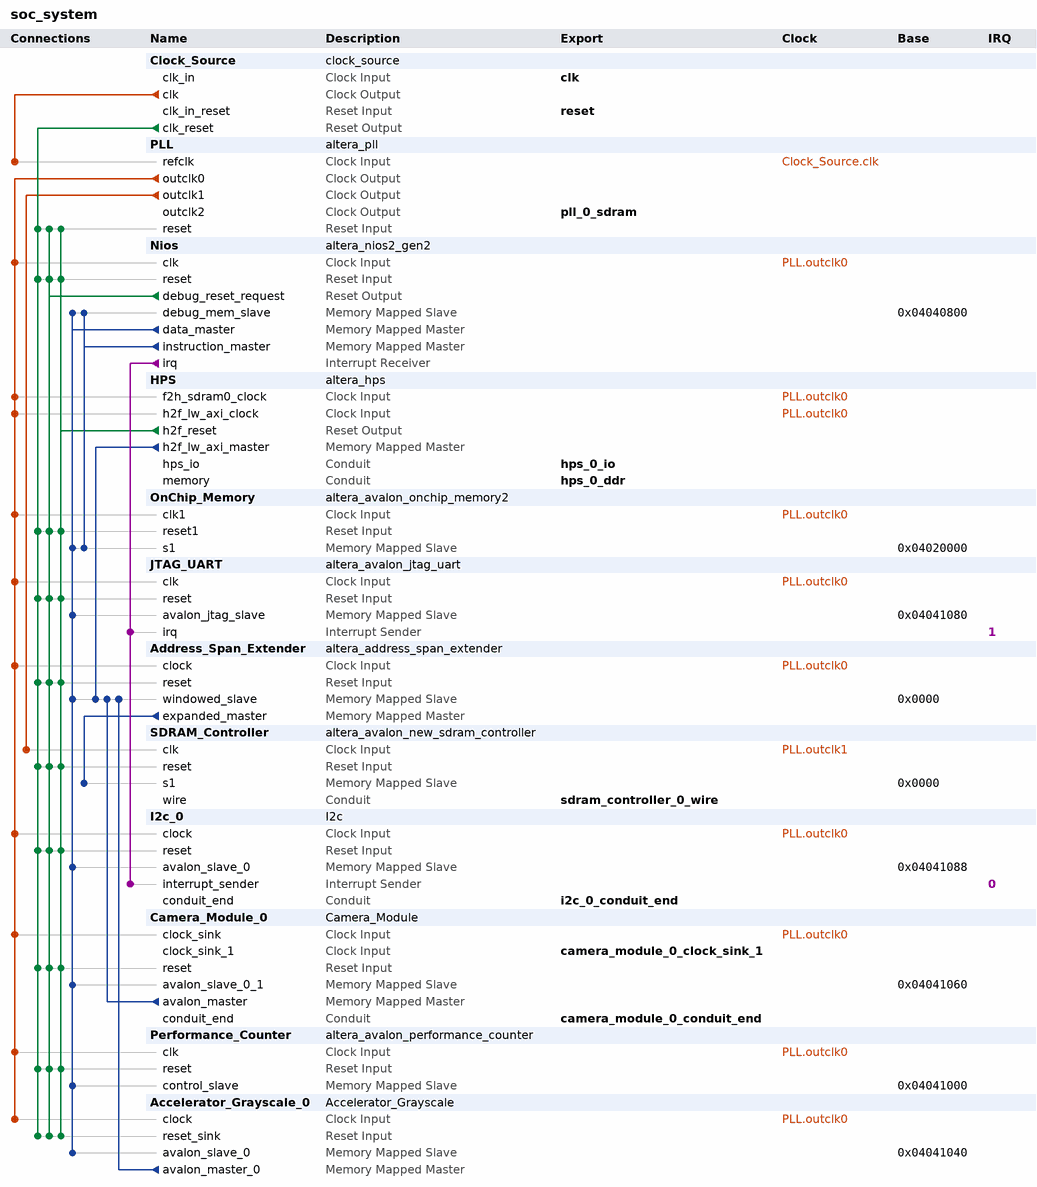
[diagram p0: system contents]
# Platform Designer (Qsys) system soc_system, Cyclone V 5CSEMA5F31C6
# Parameters at their usual value, and those the tool derives, are not listed.
package require -exact qsys 18.1
create_system soc_system
set_project_property DEVICE_FAMILY {Cyclone V}
set_project_property DEVICE 5CSEMA5F31C6

add_instance Clock_Source clock_source 18.1
set_instance_parameter_value Clock_Source clockFrequency 50000000

add_instance PLL altera_pll 18.1
set_instance_parameter_value PLL gui_device_speed_grade 2
set_instance_parameter_value PLL gui_number_of_clocks 3
set_instance_parameter_value PLL gui_operation_mode normal
set_instance_parameter_value PLL gui_output_clock_frequency0 50.0
set_instance_parameter_value PLL gui_output_clock_frequency1 100.0
set_instance_parameter_value PLL gui_output_clock_frequency2 100.0
set_instance_parameter_value PLL gui_phase_shift2 -3758
set_instance_parameter_value PLL gui_pll_mode {Integer-N PLL}
set_instance_parameter_value PLL gui_reference_clock_frequency 50.0
set_instance_parameter_value PLL gui_use_locked false

add_instance Nios altera_nios2_gen2 18.1
set_instance_parameter_value Nios dcache_size 2048
set_instance_parameter_value Nios exceptionSlave OnChip_Memory.s1
set_instance_parameter_value Nios icache_size 4096
set_instance_parameter_value Nios impl Fast
set_instance_parameter_value Nios resetSlave OnChip_Memory.s1

add_instance HPS altera_hps 18.1
set_instance_parameter_value HPS EMAC1_Mode RGMII
set_instance_parameter_value HPS EMAC1_PinMuxing {HPS I/O Set 0}
set_instance_parameter_value HPS F2SCLK_COLDRST_Enable false
set_instance_parameter_value HPS F2SCLK_DBGRST_Enable false
set_instance_parameter_value HPS F2SCLK_WARMRST_Enable false
set_instance_parameter_value HPS F2SDRAM_Type {Avalon-MM Bidirectional}
set_instance_parameter_value HPS F2SDRAM_Width 32
set_instance_parameter_value HPS F2SINTERRUPT_Enable false
set_instance_parameter_value HPS F2S_Width 0
set_instance_parameter_value HPS FPGA_PERIPHERAL_OUTPUT_CLOCK_FREQ_EMAC0_GTX_CLK 100
set_instance_parameter_value HPS FPGA_PERIPHERAL_OUTPUT_CLOCK_FREQ_EMAC0_MD_CLK 100.0
set_instance_parameter_value HPS FPGA_PERIPHERAL_OUTPUT_CLOCK_FREQ_EMAC1_GTX_CLK 100
set_instance_parameter_value HPS FPGA_PERIPHERAL_OUTPUT_CLOCK_FREQ_EMAC1_MD_CLK 100.0
set_instance_parameter_value HPS HPS_PROTOCOL DDR3
set_instance_parameter_value HPS I2C0_Mode I2C
set_instance_parameter_value HPS I2C0_PinMuxing {HPS I/O Set 0}
set_instance_parameter_value HPS I2C1_Mode I2C
set_instance_parameter_value HPS I2C1_PinMuxing {HPS I/O Set 0}
set_instance_parameter_value HPS LWH2F_Enable true
set_instance_parameter_value HPS MEM_BANKADDR_WIDTH 3
set_instance_parameter_value HPS MEM_CLK_FREQ 400.0
set_instance_parameter_value HPS MEM_COL_ADDR_WIDTH 10
set_instance_parameter_value HPS MEM_DQ_WIDTH 32
set_instance_parameter_value HPS MEM_DRV_STR RZQ/7
set_instance_parameter_value HPS MEM_ROW_ADDR_WIDTH 15
set_instance_parameter_value HPS MEM_RTT_NOM RZQ/4
set_instance_parameter_value HPS MEM_RTT_WR RZQ/4
set_instance_parameter_value HPS MEM_TCL 11
set_instance_parameter_value HPS MEM_TFAW_NS 30.0
set_instance_parameter_value HPS MEM_TRAS_NS 35.0
set_instance_parameter_value HPS MEM_TRCD_NS 13.75
set_instance_parameter_value HPS MEM_TRFC_NS 260.0
set_instance_parameter_value HPS MEM_TRP_NS 13.75
set_instance_parameter_value HPS MEM_VENDOR Other
set_instance_parameter_value HPS MEM_WTCL 8
set_instance_parameter_value HPS QSPI_Mode {1 SS}
set_instance_parameter_value HPS QSPI_PinMuxing {HPS I/O Set 0}
set_instance_parameter_value HPS REF_CLK_FREQ 25.0
set_instance_parameter_value HPS S2FCLK_USER2CLK 1
set_instance_parameter_value HPS S2F_Width 0
set_instance_parameter_value HPS SDIO_Mode {4-bit Data}
set_instance_parameter_value HPS SDIO_PinMuxing {HPS I/O Set 0}
set_instance_parameter_value HPS SPIM1_Mode {Single Slave Select}
set_instance_parameter_value HPS SPIM1_PinMuxing {HPS I/O Set 0}
set_instance_parameter_value HPS STM_Enable false
set_instance_parameter_value HPS TIMING_BOARD_AC_SKEW 0.02
set_instance_parameter_value HPS TIMING_BOARD_AC_TO_CK_SKEW 0.01
set_instance_parameter_value HPS TIMING_BOARD_DQ_TO_DQS_SKEW 0.05
set_instance_parameter_value HPS TIMING_BOARD_MAX_CK_DELAY 0.03
set_instance_parameter_value HPS TIMING_BOARD_MAX_DQS_DELAY 0.02
set_instance_parameter_value HPS TIMING_BOARD_SKEW_BETWEEN_DQS 0.06
set_instance_parameter_value HPS TIMING_BOARD_SKEW_CKDQS_DIMM_MAX 0.12
set_instance_parameter_value HPS TIMING_BOARD_SKEW_CKDQS_DIMM_MIN 0.06
set_instance_parameter_value HPS TIMING_BOARD_SKEW_WITHIN_DQS 0.01
set_instance_parameter_value HPS TIMING_TDH 65
set_instance_parameter_value HPS TIMING_TDQSCK 255
set_instance_parameter_value HPS TIMING_TDQSQ 125
set_instance_parameter_value HPS TIMING_TDS 30
set_instance_parameter_value HPS TIMING_TIH 140
set_instance_parameter_value HPS TIMING_TIS 180
set_instance_parameter_value HPS TIMING_TQSH 0.4
set_instance_parameter_value HPS UART0_Mode {No Flow Control}
set_instance_parameter_value HPS UART0_PinMuxing {HPS I/O Set 0}
set_instance_parameter_value HPS USB1_Mode SDR
set_instance_parameter_value HPS USB1_PinMuxing {HPS I/O Set 0}
set_instance_parameter_value HPS desired_cfg_clk_mhz 100.0
set_instance_parameter_value HPS desired_qspi_clk_mhz 400.0

add_instance OnChip_Memory altera_avalon_onchip_memory2 18.1
set_instance_parameter_value OnChip_Memory dataWidth 32
set_instance_parameter_value OnChip_Memory dualPort false
set_instance_parameter_value OnChip_Memory initMemContent true
set_instance_parameter_value OnChip_Memory initializationFileName onchip_mem.hex
set_instance_parameter_value OnChip_Memory memorySize 131072

add_instance JTAG_UART altera_avalon_jtag_uart 18.1
set_instance_parameter_value JTAG_UART simInteractiveOptions NO_INTERACTIVE_WINDOWS

add_instance Address_Span_Extender altera_address_span_extender 18.1
set_instance_parameter_value Address_Span_Extender BURSTCOUNT_WIDTH 1
set_instance_parameter_value Address_Span_Extender DATA_WIDTH 16
set_instance_parameter_value Address_Span_Extender ENABLE_SLAVE_PORT false
set_instance_parameter_value Address_Span_Extender MASTER_ADDRESS_DEF 0
set_instance_parameter_value Address_Span_Extender MASTER_ADDRESS_WIDTH 27
set_instance_parameter_value Address_Span_Extender MAX_PENDING_READS 1
set_instance_parameter_value Address_Span_Extender SLAVE_ADDRESS_WIDTH 19

add_instance SDRAM_Controller altera_avalon_new_sdram_controller 18.1
set_instance_parameter_value SDRAM_Controller TAC 5.4
set_instance_parameter_value SDRAM_Controller TRCD 15.0
set_instance_parameter_value SDRAM_Controller TRP 15.0
set_instance_parameter_value SDRAM_Controller casLatency 3
set_instance_parameter_value SDRAM_Controller columnWidth 10
set_instance_parameter_value SDRAM_Controller dataWidth 16
set_instance_parameter_value SDRAM_Controller generateSimulationModel false
set_instance_parameter_value SDRAM_Controller model single_Micron_MT48LC4M32B2_7_chip
set_instance_parameter_value SDRAM_Controller numberOfBanks 4
set_instance_parameter_value SDRAM_Controller numberOfChipSelects 1
set_instance_parameter_value SDRAM_Controller powerUpDelay 100.0
set_instance_parameter_value SDRAM_Controller refreshPeriod 7.8125
set_instance_parameter_value SDRAM_Controller rowWidth 13

add_instance I2c_0 I2c 1.0

add_instance Camera_Module_0 Camera_Module 1.0

add_instance Performance_Counter altera_avalon_performance_counter 18.1
set_instance_parameter_value Performance_Counter numberOfSections 3

add_instance Accelerator_Grayscale_0 Accelerator_Grayscale 1.0

# connections
add_connection Clock_Source.clk PLL.refclk clock
add_connection PLL.outclk0 Accelerator_Grayscale_0.clock clock
add_connection PLL.outclk0 Address_Span_Extender.clock clock
add_connection PLL.outclk0 Camera_Module_0.clock_sink clock
add_connection PLL.outclk0 HPS.f2h_sdram0_clock clock
add_connection PLL.outclk0 HPS.h2f_lw_axi_clock clock
add_connection PLL.outclk0 I2c_0.clock clock
add_connection PLL.outclk0 JTAG_UART.clk clock
add_connection PLL.outclk0 Nios.clk clock
add_connection PLL.outclk0 OnChip_Memory.clk1 clock
add_connection PLL.outclk0 Performance_Counter.clk clock
add_connection PLL.outclk1 SDRAM_Controller.clk clock
add_connection Clock_Source.clk_reset Accelerator_Grayscale_0.reset_sink reset
add_connection Clock_Source.clk_reset Address_Span_Extender.reset reset
add_connection Clock_Source.clk_reset Camera_Module_0.reset reset
add_connection Clock_Source.clk_reset I2c_0.reset reset
add_connection Clock_Source.clk_reset JTAG_UART.reset reset
add_connection Clock_Source.clk_reset Nios.reset reset
add_connection Clock_Source.clk_reset OnChip_Memory.reset1 reset
add_connection Clock_Source.clk_reset Performance_Counter.reset reset
add_connection Clock_Source.clk_reset PLL.reset reset
add_connection Clock_Source.clk_reset SDRAM_Controller.reset reset
add_connection HPS.h2f_reset Accelerator_Grayscale_0.reset_sink reset
add_connection HPS.h2f_reset Address_Span_Extender.reset reset
add_connection HPS.h2f_reset Camera_Module_0.reset reset
add_connection HPS.h2f_reset I2c_0.reset reset
add_connection HPS.h2f_reset JTAG_UART.reset reset
add_connection HPS.h2f_reset Nios.reset reset
add_connection HPS.h2f_reset OnChip_Memory.reset1 reset
add_connection HPS.h2f_reset Performance_Counter.reset reset
add_connection HPS.h2f_reset PLL.reset reset
add_connection HPS.h2f_reset SDRAM_Controller.reset reset
add_connection Nios.debug_reset_request Accelerator_Grayscale_0.reset_sink reset
add_connection Nios.debug_reset_request Address_Span_Extender.reset reset
add_connection Nios.debug_reset_request Camera_Module_0.reset reset
add_connection Nios.debug_reset_request I2c_0.reset reset
add_connection Nios.debug_reset_request JTAG_UART.reset reset
add_connection Nios.debug_reset_request Nios.reset reset
add_connection Nios.debug_reset_request OnChip_Memory.reset1 reset
add_connection Nios.debug_reset_request Performance_Counter.reset reset
add_connection Nios.debug_reset_request PLL.reset reset
add_connection Nios.debug_reset_request SDRAM_Controller.reset reset
add_connection Accelerator_Grayscale_0.avalon_master_0 Address_Span_Extender.windowed_slave avalon
set_connection_parameter_value Accelerator_Grayscale_0.avalon_master_0/Address_Span_Extender.windowed_slave baseAddress 0x0000
add_connection Address_Span_Extender.expanded_master SDRAM_Controller.s1 avalon
set_connection_parameter_value Address_Span_Extender.expanded_master/SDRAM_Controller.s1 baseAddress 0x0000
add_connection Camera_Module_0.avalon_master Address_Span_Extender.windowed_slave avalon
set_connection_parameter_value Camera_Module_0.avalon_master/Address_Span_Extender.windowed_slave baseAddress 0x0000
add_connection HPS.h2f_lw_axi_master Address_Span_Extender.windowed_slave avalon
set_connection_parameter_value HPS.h2f_lw_axi_master/Address_Span_Extender.windowed_slave baseAddress 0x0000
add_connection Nios.data_master Accelerator_Grayscale_0.avalon_slave_0 avalon
set_connection_parameter_value Nios.data_master/Accelerator_Grayscale_0.avalon_slave_0 baseAddress 0x04041040
add_connection Nios.data_master Address_Span_Extender.windowed_slave avalon
set_connection_parameter_value Nios.data_master/Address_Span_Extender.windowed_slave baseAddress 0x0000
add_connection Nios.data_master Camera_Module_0.avalon_slave_0_1 avalon
set_connection_parameter_value Nios.data_master/Camera_Module_0.avalon_slave_0_1 baseAddress 0x04041060
add_connection Nios.data_master I2c_0.avalon_slave_0 avalon
set_connection_parameter_value Nios.data_master/I2c_0.avalon_slave_0 baseAddress 0x04041088
add_connection Nios.data_master JTAG_UART.avalon_jtag_slave avalon
set_connection_parameter_value Nios.data_master/JTAG_UART.avalon_jtag_slave baseAddress 0x04041080
add_connection Nios.data_master Nios.debug_mem_slave avalon
set_connection_parameter_value Nios.data_master/Nios.debug_mem_slave baseAddress 0x04040800
add_connection Nios.data_master OnChip_Memory.s1 avalon
set_connection_parameter_value Nios.data_master/OnChip_Memory.s1 baseAddress 0x04020000
add_connection Nios.data_master Performance_Counter.control_slave avalon
set_connection_parameter_value Nios.data_master/Performance_Counter.control_slave baseAddress 0x04041000
add_connection Nios.instruction_master Nios.debug_mem_slave avalon
set_connection_parameter_value Nios.instruction_master/Nios.debug_mem_slave baseAddress 0x04040800
add_connection Nios.instruction_master OnChip_Memory.s1 avalon
set_connection_parameter_value Nios.instruction_master/OnChip_Memory.s1 baseAddress 0x04020000
add_connection Nios.irq I2c_0.interrupt_sender interrupt
set_connection_parameter_value Nios.irq/I2c_0.interrupt_sender irqNumber 0
add_connection Nios.irq JTAG_UART.irq interrupt
set_connection_parameter_value Nios.irq/JTAG_UART.irq irqNumber 1

# exported interfaces
add_interface camera_module_0_clock_sink_1 clock sink
set_interface_property camera_module_0_clock_sink_1 EXPORT_OF Camera_Module_0.clock_sink_1
add_interface camera_module_0_conduit_end conduit end
set_interface_property camera_module_0_conduit_end EXPORT_OF Camera_Module_0.conduit_end
add_interface clk clock sink
set_interface_property clk EXPORT_OF Clock_Source.clk_in
add_interface hps_0_ddr conduit end
set_interface_property hps_0_ddr EXPORT_OF HPS.memory
add_interface hps_0_io conduit end
set_interface_property hps_0_io EXPORT_OF HPS.hps_io
add_interface i2c_0_conduit_end conduit end
set_interface_property i2c_0_conduit_end EXPORT_OF I2c_0.conduit_end
add_interface pll_0_sdram clock source
set_interface_property pll_0_sdram EXPORT_OF PLL.outclk2
add_interface reset reset sink
set_interface_property reset EXPORT_OF Clock_Source.clk_in_reset
add_interface sdram_controller_0_wire conduit end
set_interface_property sdram_controller_0_wire EXPORT_OF SDRAM_Controller.wire

set_interconnect_requirement {$system} qsys_mm.clockCrossingAdapter HANDSHAKE
set_interconnect_requirement {$system} qsys_mm.insertDefaultSlave FALSE
set_interconnect_requirement {$system} qsys_mm.maxAdditionalLatency 1

save_system soc_system.qsys
